# EAGLE design Vers. 4 Moppy Board (EAGLE 9.1.3)
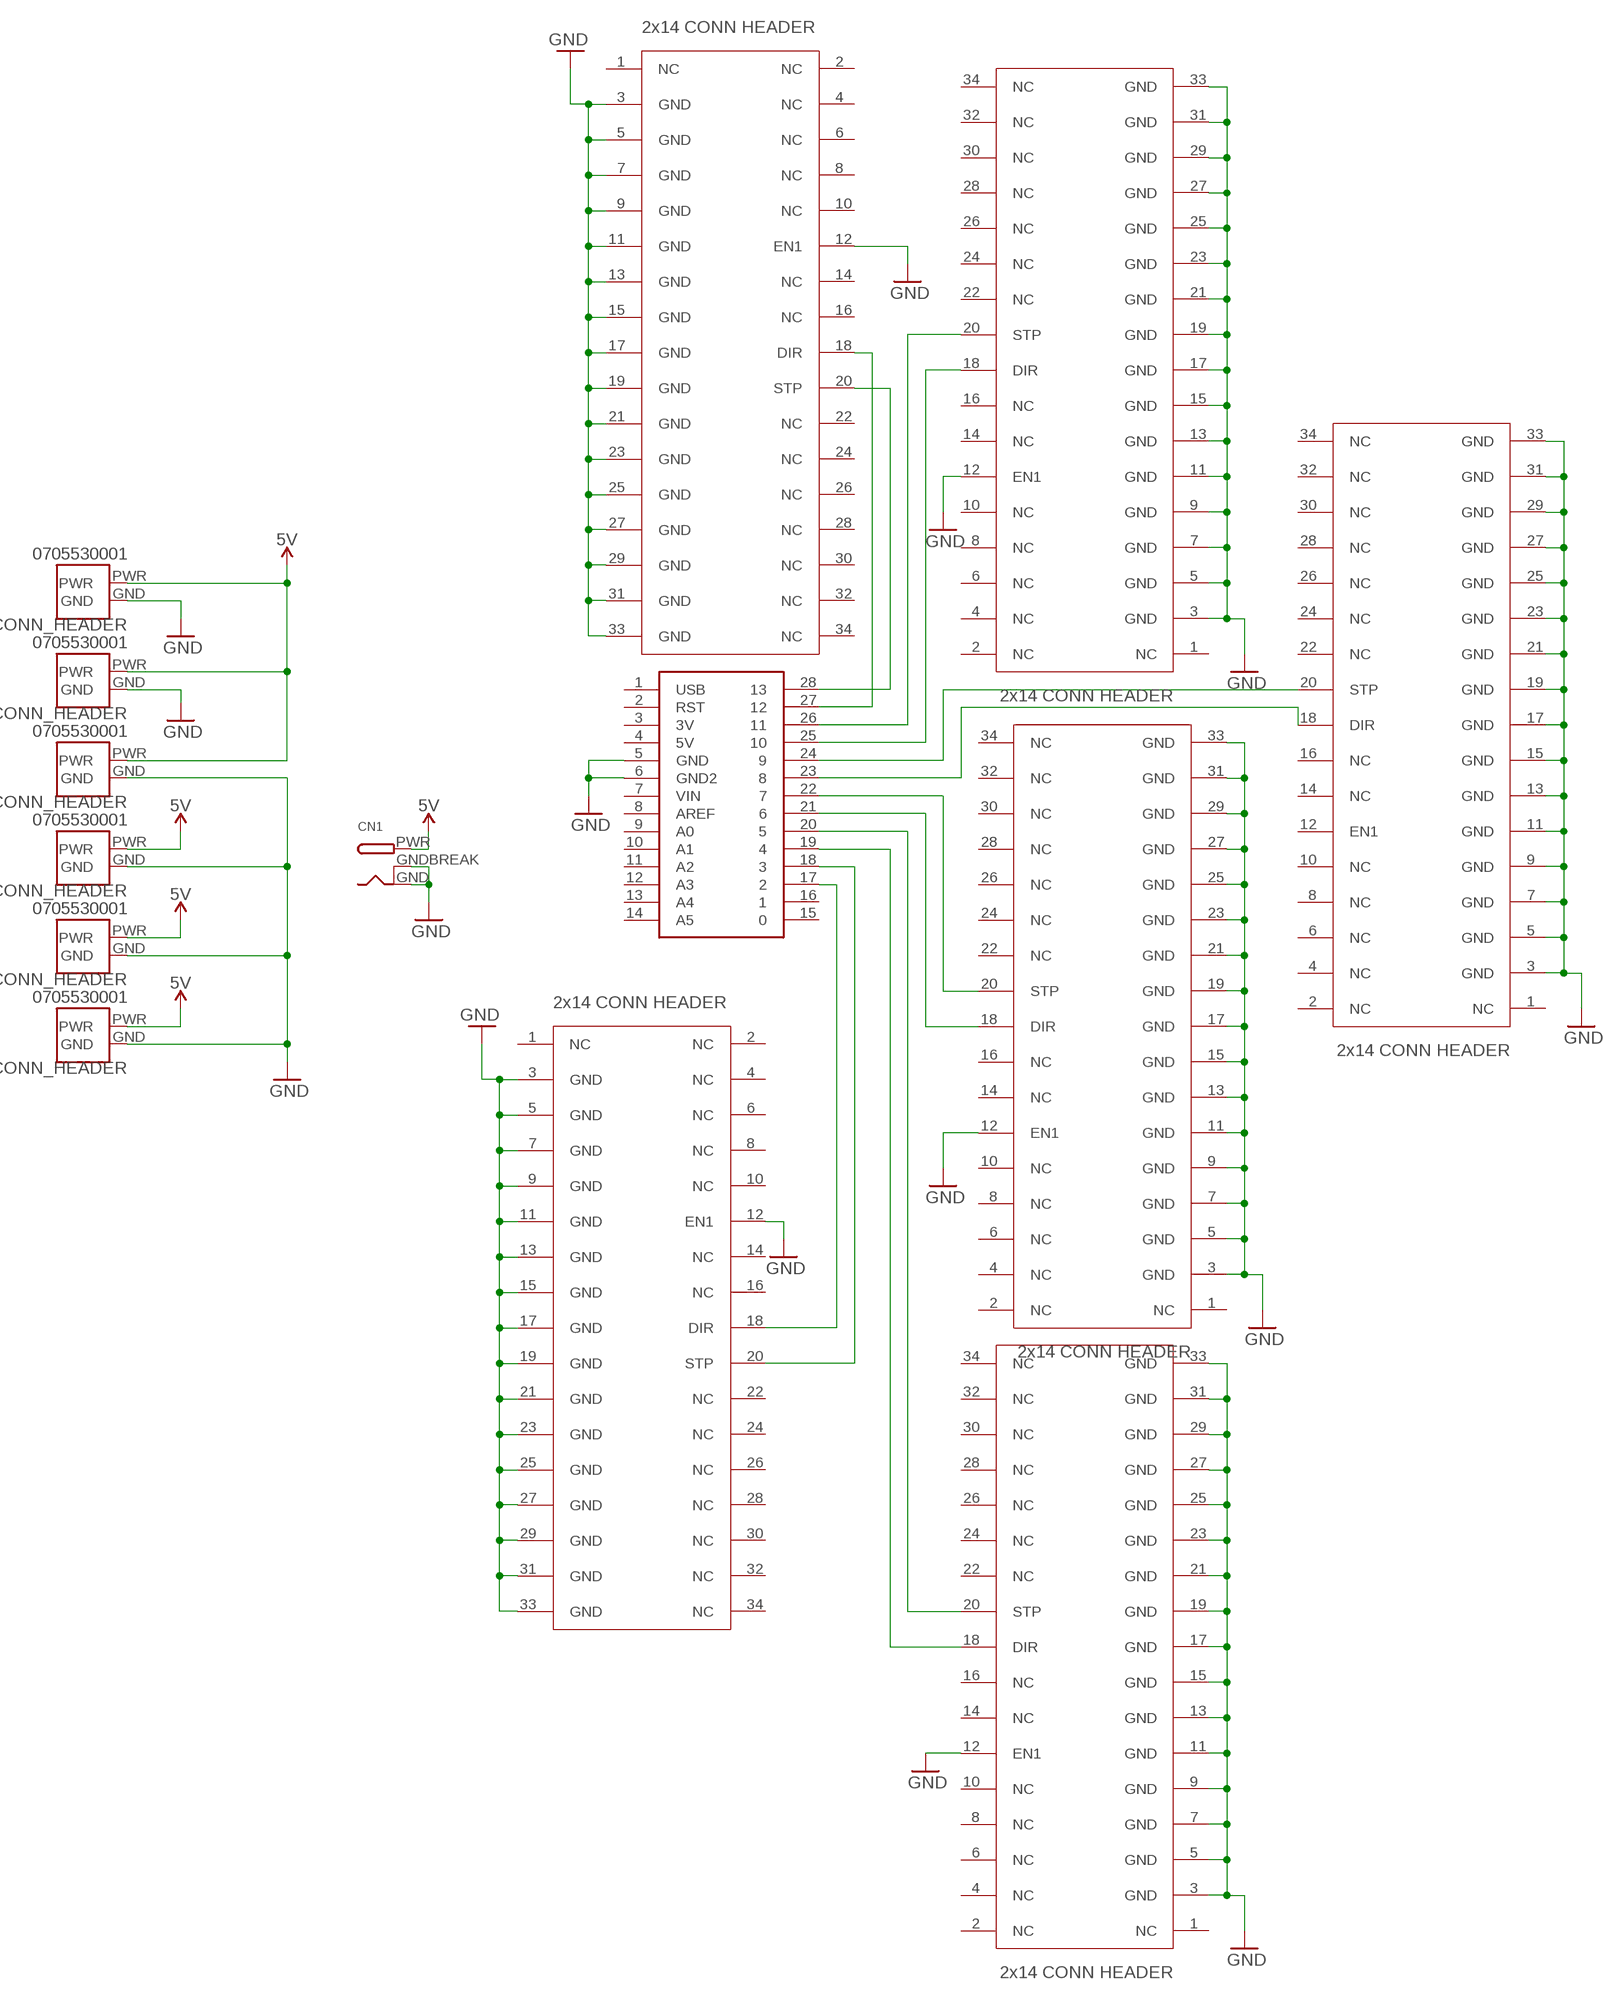
[diagram p0: schematic, sheet 1]

## Parts
CN1  DCBARRELPTH  [DCJACK_2MM_PTH]
U$1  2X14_CONN_HEADER  [2X17_CONN_HEADER]
U$2  2X14_CONN_HEADER  [2X17_CONN_HEADER]
U$3  2X14_CONN_HEADER  [2X17_CONN_HEADER]
U$4  2X14_CONN_HEADER  [2X17_CONN_HEADER]
U$5  2X14_CONN_HEADER  [2X17_CONN_HEADER]
U$6  2X14_CONN_HEADER  [2X17_CONN_HEADER]
U$8  METROMINI  [METROMINI]
X1  0705530001  [MOLEX_0705530001]
X2  0705530001  [MOLEX_0705530001]
X3  0705530001  [MOLEX_0705530001]
X4  0705530001  [MOLEX_0705530001]
X5  0705530001  [MOLEX_0705530001]
X6  0705530001  [MOLEX_0705530001]

## Nets
5V: CN1.PWR X1.PWR X2.PWR X3.PWR X4.PWR X5.PWR X6.PWR
GND: CN1.GND CN1.GNDBREAK U$1.3(GND) U$1.5(GND) U$1.7(GND) U$1.9(GND) U$1.11(GND) U$1.12(EN1) U$1.13(GND) U$1.15(GND) U$1.17(GND) U$1.19(GND) U$1.21(GND) U$1.23(GND) U$1.25(GND) U$1.27(GND) U$1.29(GND) U$1.31(GND) U$1.33(GND) U$2.3(GND) U$2.5(GND) U$2.7(GND) U$2.9(GND) U$2.11(GND) U$2.12(EN1) U$2.13(GND) U$2.15(GND) U$2.17(GND) U$2.19(GND) U$2.21(GND) U$2.23(GND) U$2.25(GND) U$2.27(GND) U$2.29(GND) U$2.31(GND) U$2.33(GND) U$3.3(GND) U$3.5(GND) U$3.7(GND) U$3.9(GND) U$3.11(GND) U$3.12(EN1) U$3.13(GND) U$3.15(GND) U$3.17(GND) U$3.19(GND) U$3.21(GND) U$3.23(GND) U$3.25(GND) U$3.27(GND) U$3.29(GND) U$3.31(GND) U$3.33(GND) U$4.3(GND) U$4.5(GND) U$4.7(GND) U$4.9(GND) U$4.11(GND) U$4.12(EN1) U$4.13(GND) U$4.15(GND) U$4.17(GND) U$4.19(GND) U$4.21(GND) U$4.23(GND) U$4.25(GND) U$4.27(GND) U$4.29(GND) U$4.31(GND) U$4.33(GND) U$5.3(GND) U$5.5(GND) U$5.7(GND) U$5.9(GND) U$5.11(GND) U$5.12(EN1) U$5.13(GND) U$5.15(GND) U$5.17(GND) U$5.19(GND) U$5.21(GND) U$5.23(GND) U$5.25(GND) U$5.27(GND) U$5.29(GND) U$5.31(GND) U$5.33(GND) U$6.3(GND) U$6.5(GND) U$6.7(GND) U$6.9(GND) U$6.11(GND) U$6.13(GND) U$6.15(GND) U$6.17(GND) U$6.19(GND) U$6.21(GND) U$6.23(GND) U$6.25(GND) U$6.27(GND) U$6.29(GND) U$6.31(GND) U$6.33(GND) U$8.5(GND) U$8.6(GND2) X1.GND X2.GND X3.GND X4.GND X5.GND X6.GND
N$1: U$2.20(STP) U$8.28
N$2: U$2.18(DIR) U$8.27
N$3: U$3.20(STP) U$8.26
N$4: U$3.18(DIR) U$8.25
N$5: U$5.20(STP) U$8.22
N$6: U$5.18(DIR) U$8.21
N$7: U$1.18(DIR) U$8.17
N$8: U$4.18(DIR) U$8.19
N$9: U$1.20(STP) U$8.18
N$10: U$6.20(STP) U$8.24
N$11: U$4.20(STP) U$8.20
N$12: U$6.18(DIR) U$8.23
Unconnected: U$1.1(NC) U$1.2(NC) U$1.4(NC) U$1.6(NC) U$1.8(NC) U$1.10(NC) U$1.14(NC) U$1.16(NC) U$1.22(NC) U$1.24(NC) U$1.26(NC) U$1.28(NC) U$1.30(NC) U$1.32(NC) U$1.34(NC) U$2.1(NC) U$2.2(NC) U$2.4(NC) U$2.6(NC) U$2.8(NC) U$2.10(NC) U$2.14(NC) U$2.16(NC) U$2.22(NC) U$2.24(NC) U$2.26(NC) U$2.28(NC) U$2.30(NC) U$2.32(NC) U$2.34(NC) U$3.1(NC) U$3.2(NC) U$3.4(NC) U$3.6(NC) U$3.8(NC) U$3.10(NC) U$3.14(NC) U$3.16(NC) U$3.22(NC) U$3.24(NC) U$3.26(NC) U$3.28(NC) U$3.30(NC) U$3.32(NC) U$3.34(NC) U$4.1(NC) U$4.2(NC) U$4.4(NC) U$4.6(NC) U$4.8(NC) U$4.10(NC) U$4.14(NC) U$4.16(NC) U$4.22(NC) U$4.24(NC) U$4.26(NC) U$4.28(NC) U$4.30(NC) U$4.32(NC) U$4.34(NC) U$5.1(NC) U$5.2(NC) U$5.4(NC) U$5.6(NC) U$5.8(NC) U$5.10(NC) U$5.14(NC) U$5.16(NC) U$5.22(NC) U$5.24(NC) U$5.26(NC) U$5.28(NC) U$5.30(NC) U$5.32(NC) U$5.34(NC) U$6.1(NC) U$6.2(NC) U$6.4(NC) U$6.6(NC) U$6.8(NC) U$6.10(NC) U$6.12(EN1) U$6.14(NC) U$6.16(NC) U$6.22(NC) U$6.24(NC) U$6.26(NC) U$6.28(NC) U$6.30(NC) U$6.32(NC) U$6.34(NC) U$8.1(USB) U$8.2(RST) U$8.3(3V) U$8.4(5V) U$8.7(VIN) U$8.8(AREF) U$8.9(A0) U$8.10(A1) U$8.11(A2) U$8.12(A3) U$8.13(A4) U$8.14(A5) U$8.15 U$8.16

## Library data of the parts
CN1 = adafruit:DCBARREL: 2.0mm DC Barrel Jack DCJACK_2MM_PTH - Through Hole Jack (4UConnector: 05537)
U$1-U$6 = Danielle's Library:2X14_CONN_HEADER
U$8 = MetroMINI:METROMINI
X1-X6 = 2.54_CONN_HEADER:0705530001: Conn Shrouded Header HDR 2 POS 2.54mm Solder RA Thru-Hole SLÃ¢âÂ¢ Tube; DESCRIPTION: Conn Shrouded Header HDR 2 POS 2.54mm Solder RA Thru-Hole SLÃ¢âÂ¢ Tube; DIGI-KEY_PART_NUMBER: WM4900-ND; DIGI-KEY_PURCHASE_URL: https://www.digikey.com/product-detail/en/molex/0705530001/WM4900-ND/114951?utm_source=snapeda&utm_medium=aggregator&utm_campaign=symbol; MF: Molex; MP: 0705530001; PACKAGE: None

## Board
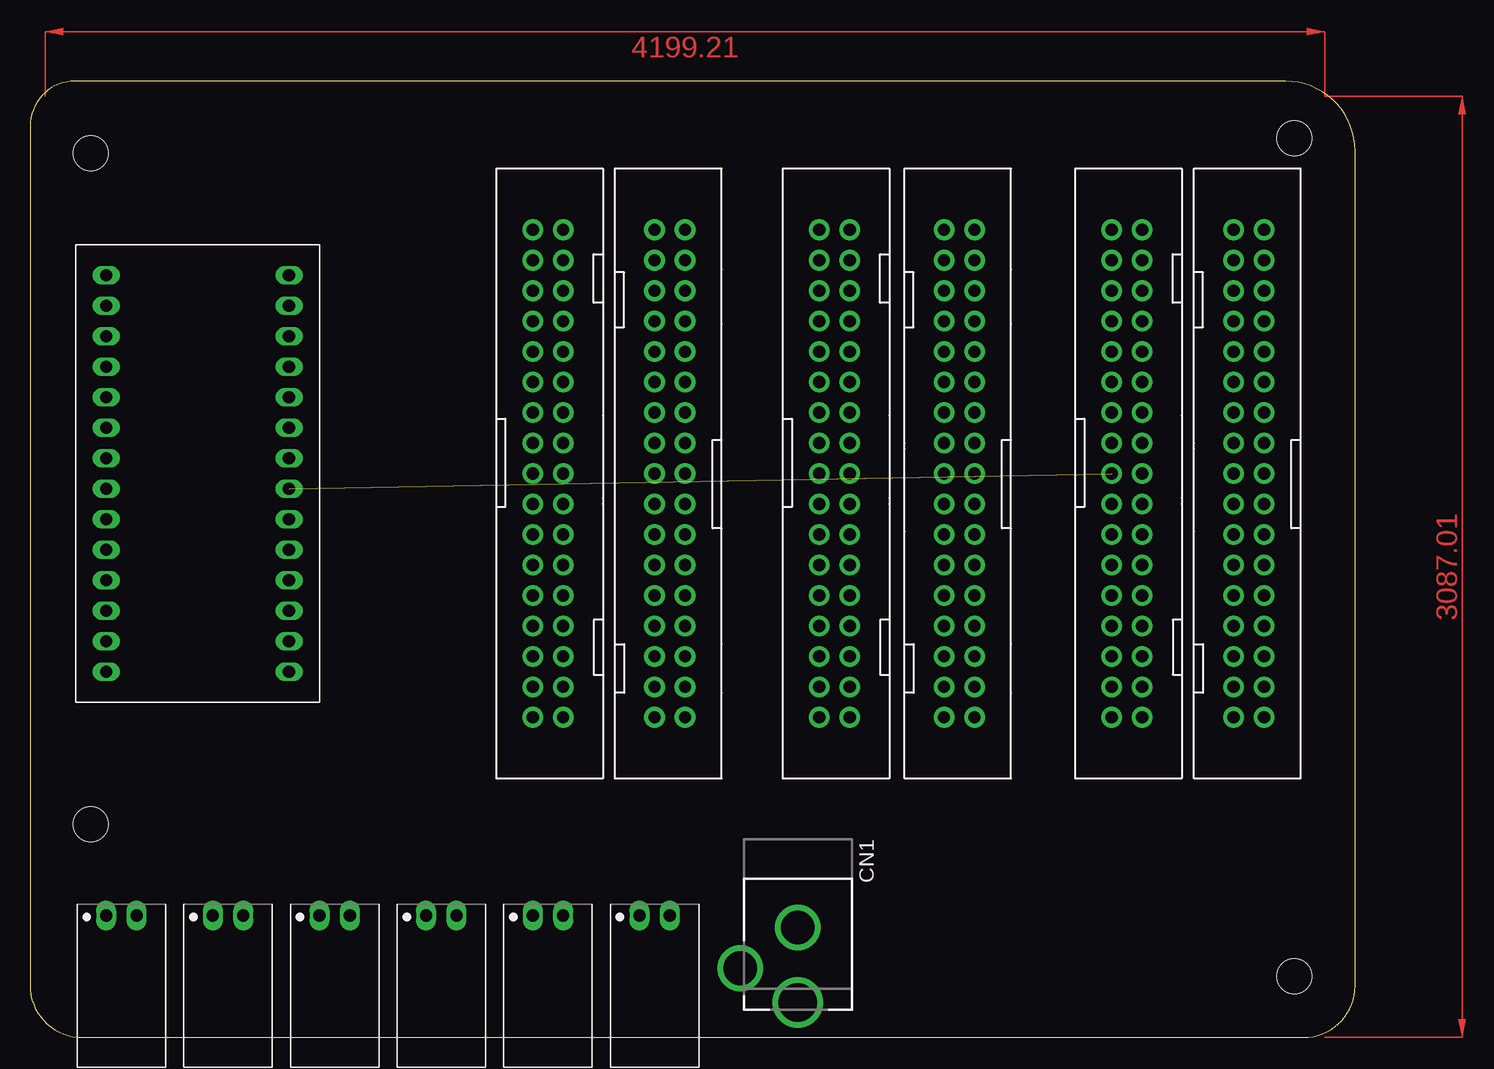
[diagram p1: board, top side]
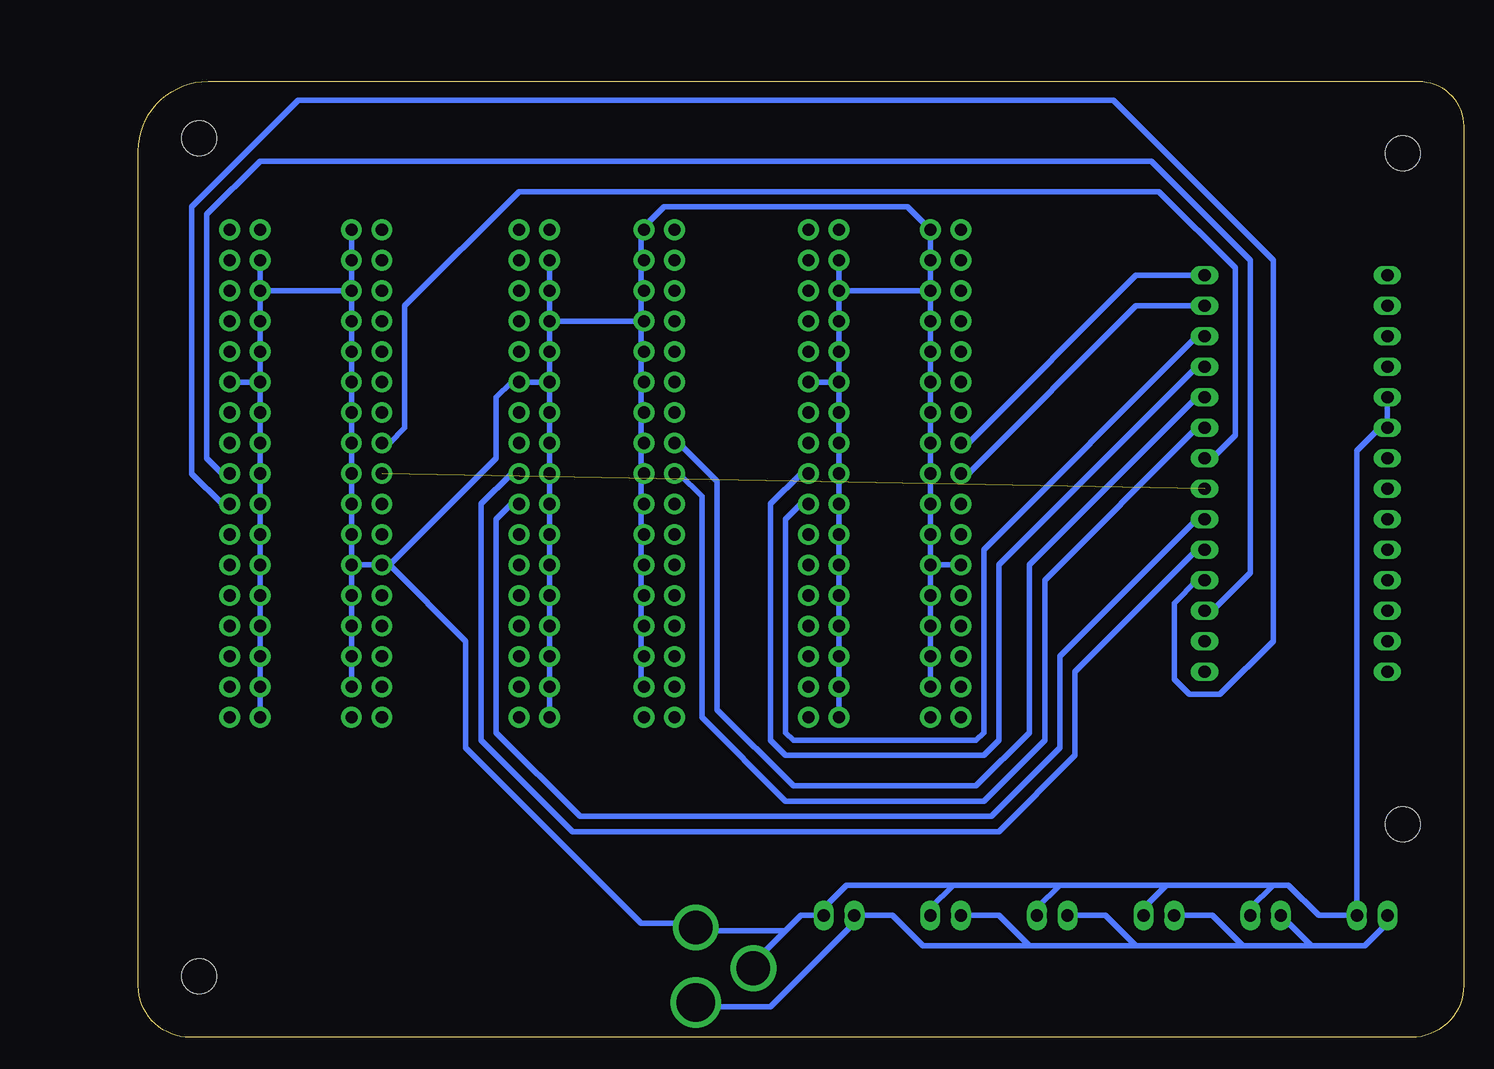
[diagram p2: board, bottom side, seen from below]

Size 110.47 x 79.68 mm. Coordinates in mm from the lower left corner, seen from the top.
Outline: 0,75.92 0,4.34 arc90 4.34,0 106.17,0 arc90 110.47,4.3 110.47,73.87 arc90 104.66,79.68 3.75,79.68 arc90 0,75.92
Copper layers (1*16): Top 0.035mm / dielectric 1.5mm / Bottom 0.035mm
Design rules "OthermillDRC_1_32_v2 *": minimum track width 18mil, minimum drill 0.8mm, track to track 0.794003125mm, track to pad 0.794003125mm, pad to pad 0.794003125mm, via to via 0.794003125mm, smd to smd 0mil, copper to edge 0mil, drill to drill 1mil, minimum pad ring 10mil, minimum via ring 10mil, stop-mask expansion 1mil, vias tented up to drill 30mil, thermal gap 10mil
Holes 2.9 mm at 105.41,5.08 5.08,73.66 105.41,74.93 5.08,17.78

### Footprints (pad centres in the part's own frame; a part is rotated, then mirrored left to right if it is on the bottom)
DCJACK_2MM_PTH = drill 2.8: GND 0,7.35; GNDBREAK 4.8,10.75 | drill 3.2: PWR 0,13.6
2X17_CONN_HEADER = drill 1.016 pad 1.727: 1 -25.4,-5.08; 2 -25.4,-2.54; 3 -22.86,-5.08; 4 -22.86,-2.54; 5 -20.32,-5.08; 6 -20.32,-2.54; 7 -17.78,-5.08; 8 -17.78,-2.54; 9 -15.24,-5.08; 10 -15.24,-2.54; 11 -12.7,-5.08; 12 -12.7,-2.54; 13 -10.16,-5.08; 14 -10.16,-2.54; 15 -7.62,-5.08; 16 -7.62,-2.54; 17 -5.08,-5.08; 18 -5.08,-2.54; 19 -2.54,-5.08; 20 -2.54,-2.54; 21 0,-5.08; 22 0,-2.54; 23 2.54,-5.08; 24 2.54,-2.54; 25 5.08,-5.08; 26 5.08,-2.54; 27 7.62,-5.08; 28 7.62,-2.54; 29 10.16,-5.08; 30 10.16,-2.54; 31 12.7,-5.08; 32 12.7,-2.54; 33 15.24,-5.08; 34 15.24,-2.54
METROMINI = drill 1.016 long: 1 -11.43,0; 2 -8.89,0; 3 -6.35,0; 4 -3.81,0; 5 -1.27,0; 6 1.27,0; 7 3.81,0; 8 6.35,0; 9 8.89,0; 10 11.43,0; 11 13.97,0; 12 16.51,0; 13 19.05,0; 14 21.59,0; 15 21.59,15.24; 16 19.05,15.24; 17 16.51,15.24; 18 13.97,15.24; 19 11.43,15.24; 20 8.89,15.24; 21 6.35,15.24; 22 3.81,15.24; 23 1.27,15.24; 24 -1.27,15.24; 25 -3.81,15.24; 26 -6.35,15.24; 27 -8.89,15.24; 28 -11.43,15.24
MOLEX_0705530001 = drill 1.016 pad 1.651 long: GND 2.54,0; PWR 0,0

### Placement (x,y rotation side)
CN1  64.01,16.51 180 top
U$1  105.41,41.91 270 top
U$2  39.37,52.07 90 top
U$3  57.15,41.91 270 top
U$4  81.28,41.91 270 top
U$5  87.63,52.07 90 top
U$6  63.25,52.07 90 top
U$8  6.35,52.07 270 top
X1  50.8,10.16 0 top
X2  41.91,10.16 0 top
X3  6.35,10.16 0 top
X4  15.24,10.16 0 top
X5  24.13,10.16 0 top
X6  33.02,10.16 0 top

### Tracks (layer width: path | path; a pad name or v marks a point on that pad's centre or on a via)
5V
  Bottom 0.457: X3.PWR 6.35,9.52 8.25,7.62 12.7,7.62 | X4.PWR 12.7,7.62 | X5.PWR 20.96,10.16 18.41,7.62 | 12.7,7.62 18.41,7.62 | X6.PWR 29.84,10.16 27.3,7.62 | 18.41,7.62 27.3,7.62 | X2.PWR 38.73,10.16 36.2,7.62 | 27.3,7.62 36.2,7.62 | 50.17,10.16 47.62,10.16 45.09,7.62 36.2,7.62 | 50.17,10.16 57.78,2.54 63.5,2.54 CN1.PWR | 50.17,10.16 X1.PWR
GND
  Bottom 0.457: U$1.3 U$1.5 | U$1.11 U$1.13 U$1.15 U$1.17 U$1.19 U$1.21 U$1.23 U$1.25 U$1.27 U$1.29 U$1.31 U$1.33 | U$1.11 U$1.12 | U$1.11 U$1.9 U$1.7 U$1.5 | U$5.3 U$5.5 U$5.7 U$5.9 U$5.11 | U$5.29 U$5.31 U$5.33 | U$5.11 U$5.12 89.53,39.37 | U$5.11 U$5.13 U$5.15 U$5.17 U$5.19 U$5.21 U$5.23 U$5.25 U$5.27 U$5.29 | U$5.29 U$1.5 | 68.58,64.77 68.58,67.31 U$6.33 67.95,67.31 67.95,67.94 66.67,69.21 46.36,69.21 U$2.33 U$2.31 U$2.29 | 68.58,62.23 68.58,59.69 | 68.58,57.15 68.58,54.61 | 68.58,52.07 68.58,49.53 | 68.58,46.99 68.58,44.45 | 68.58,41.91 68.58,39.37 | 68.58,31.75 68.58,29.21 U$6.3 | 68.58,36.83 68.58,34.29 | 68.58,34.29 68.58,31.75 | 68.58,31.75 U$6.5 | 68.58,34.29 U$6.7 | 68.58,36.83 68.58,39.37 | 68.58,39.37 U$6.11 | 68.58,36.83 U$6.9 | 68.58,41.91 68.58,44.45 | 68.58,44.45 U$6.15 | 68.58,41.91 U$6.13 | 68.58,46.99 68.58,49.53 | 68.58,49.53 U$6.19 | 68.58,46.99 U$6.17 | 68.58,52.07 68.58,54.61 | 68.58,54.61 U$6.23 | 68.58,52.07 U$6.21 | 68.58,57.15 68.58,59.69 | 68.58,57.15 U$6.25 | 68.58,62.23 68.58,64.77 | 68.58,64.77 U$6.31 | 68.58,62.23 U$6.29 | U$4.3 U$4.5 U$4.7 | U$4.7 U$4.9 U$4.11 | U$4.11 U$4.13 U$4.15 U$4.17 U$4.19 U$4.21 U$4.23 U$4.25 U$4.27 U$4.29 U$4.31 U$4.33 | U$4.11 U$4.12 79.38,54.61 80.64,53.34 80.64,48.26 89.53,39.37 | U$4.7 68.58,59.69 | 68.58,59.69 U$6.27 | U$3.3 U$3.5 | U$3.11 U$3.13 U$3.15 U$3.17 U$3.19 U$3.21 U$3.23 U$3.25 U$3.27 U$3.29 U$3.31 U$3.33 | U$3.11 U$3.12 | U$3.11 U$3.9 U$3.7 U$3.5 | U$2.3 U$2.5 U$2.7 U$2.9 U$2.11 | U$2.11 U$2.12 | U$2.11 U$2.13 U$2.15 U$2.17 U$2.19 U$2.21 U$2.23 U$2.25 U$2.27 U$2.29 | U$2.29 U$3.5 | 56.52,8.89 59.06,6.35 CN1.GNDBREAK | 56.52,8.89 55.25,10.16 X1.GND 53.34,10.79 51.44,12.7 42.55,12.7
  Bottom 0.457: 56.52,8.89 63.5,8.89 CN1.GND 64.14,9.52 68.58,9.52 83.19,24.13 83.19,33.02 89.53,39.37 | U$8.5 U$8.6 6.98,50.8 8.89,48.9 X3.GND 12.07,10.16 14.61,12.7 15.87,12.7 | 15.87,12.7 17.78,10.79 X4.GND | X5.GND 26.67,10.79 24.76,12.7 | 15.87,12.7 24.76,12.7 | X6.GND 35.56,10.79 33.66,12.7 | 24.76,12.7 33.66,12.7 | X2.GND 44.45,10.79 42.55,12.7 | 33.66,12.7 42.55,12.7
N$1
  Bottom 0.457: U$8.28 27.3,63.5 41.28,49.53 U$2.20
N$2
  Bottom 0.457: U$8.27 27.3,60.96 41.28,46.99 U$2.18
N$3
  Bottom 0.457: U$8.26 22.22,58.42 40,40.64 40,25.4 40.64,24.76 55.88,24.76 56.52,25.4 56.52,43.18 55.25,44.45 U$3.20
N$4
  Bottom 0.457: U$8.25 22.22,55.88 38.73,39.37 38.73,24.76 40,23.49 56.52,23.49 57.78,24.76 57.78,44.45 55.25,46.99 U$3.18
N$5
  Bottom 0.457: U$8.22 20.96,48.26 19.05,50.16 19.05,64.13 25.4,70.48 78.74,70.48 88.27,60.96 88.27,50.8 89.53,49.53 U$5.20
N$6  (1 unrouted)
N$7
  Bottom 0.457: U$8.17 20.96,35.56 17.78,38.73 17.78,64.77 26.04,73.02 100.33,73.02 104.78,68.58 104.78,48.26 103.5,46.99 U$1.18
N$8
  Bottom 0.457: U$8.19 22.22,40.64 32.39,30.48 32.39,23.49 38.73,17.14 74.3,17.14 81.92,24.76 81.92,44.45 79.38,46.99 U$4.18
N$9
  Bottom 0.457: U$8.18 22.22,38.1 24.13,36.2 24.13,29.85 22.86,28.57 20.32,28.57 15.87,33.02 15.87,64.77 29.21,78.1 97.16,78.1 106.05,69.21 106.05,46.99 103.5,44.45 U$1.20
N$10
  Bottom 0.457: U$8.24 22.22,53.34 36.2,39.37 36.2,25.4 40.64,20.95 55.88,20.95 62.23,27.3 62.23,46.36 65.41,49.53 U$6.20
N$11
  Bottom 0.457: U$8.20 22.22,43.18 33.66,31.75 33.66,24.13 39.37,18.41 73.66,18.41 80.64,25.4 80.64,43.18 79.38,44.45 U$4.20
N$12
  Bottom 0.457: U$8.23 22.22,50.8 34.92,38.1 34.92,24.76 40,19.68 56.52,19.68 63.5,26.67 63.5,45.09 65.41,46.99 U$6.18
(copper drawn outside any net)
  shapes: Top area x2